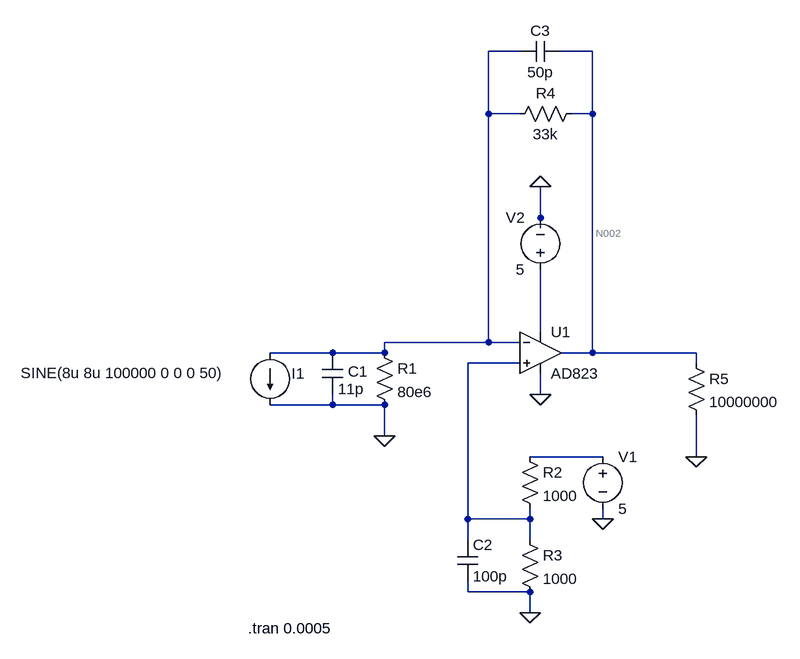
[diagram p0: schematic Optical tachometer circuit.asc]
Optical tachometer circuit.asc, the LTspice schematic file:
Version 4
SHEET 1 880 680
WIRE 192 -320 144 -320
WIRE 304 -320 256 -320
WIRE 144 -224 144 -320
WIRE 192 -224 144 -224
WIRE 304 -224 304 -320
WIRE 304 -224 272 -224
WIRE 224 -64 224 -112
WIRE 224 -48 224 -64
WIRE 224 112 224 16
WIRE 144 128 144 -224
WIRE 144 128 -16 128
WIRE 192 128 144 128
WIRE -96 144 -192 144
WIRE -16 144 -16 128
WIRE -16 144 -96 144
WIRE 304 144 304 -224
WIRE 304 144 256 144
WIRE 464 144 304 144
WIRE 192 160 112 160
WIRE 464 160 464 144
WIRE 224 208 224 176
WIRE -96 224 -96 208
WIRE -96 224 -192 224
WIRE -16 224 -96 224
WIRE -16 272 -16 224
WIRE 320 304 208 304
WIRE 464 304 464 240
WIRE 112 400 112 160
WIRE 208 400 208 384
WIRE 208 400 112 400
WIRE 320 400 320 384
WIRE 112 432 112 400
WIRE 208 432 208 400
WIRE 112 512 112 496
WIRE 208 512 112 512
WIRE 208 544 208 512
FLAG -16 272 0
FLAG 208 544 0
FLAG 464 304 0
FLAG 224 208 0
FLAG 320 400 0
FLAG 224 -112 0
SYMBOL OpAmps\\AD823 224 80 R0
SYMATTR InstName U1
SYMBOL cap -112 144 R0
WINDOW 0 40 29 Left 2
SYMATTR InstName C1
SYMATTR Value 11p
SYMBOL res -32 128 R0
SYMATTR InstName R1
SYMATTR Value 80e6
SYMBOL current -192 144 R0
WINDOW 0 33 32 Left 2
WINDOW 3 -384 31 Left 2
WINDOW 123 0 0 Left 0
WINDOW 39 0 0 Left 0
SYMATTR InstName I1
SYMATTR Value SINE(8u 8u 100000 0 0 0 50)
SYMBOL res 192 288 R0
SYMATTR InstName R2
SYMATTR Value 1000
SYMBOL res 192 416 R0
SYMATTR InstName R3
SYMATTR Value 1000
SYMBOL cap 96 432 R0
SYMATTR InstName C2
SYMATTR Value 100p
SYMBOL res 288 -240 R90
WINDOW 0 0 56 VBottom 2
WINDOW 3 32 56 VTop 2
SYMATTR InstName R4
SYMATTR Value 33k
SYMBOL cap 256 -336 R90
WINDOW 0 0 32 VBottom 2
WINDOW 3 32 32 VTop 2
SYMATTR InstName C3
SYMATTR Value 50p
SYMBOL res 448 144 R0
SYMATTR InstName R5
SYMATTR Value 10000000
SYMBOL voltage 320 288 R0
WINDOW 123 0 0 Left 0
WINDOW 39 0 0 Left 0
SYMATTR InstName V1
SYMATTR Value 5
SYMBOL voltage 224 32 R180
WINDOW 0 24 96 Left 2
WINDOW 3 24 16 Left 2
WINDOW 123 0 0 Left 0
WINDOW 39 0 0 Left 0
SYMATTR InstName V2
SYMATTR Value 5
TEXT -226 568 Left 2 !.tran 0.0005

The netlist it stands for:
* Optical tachometer circuit.asc
XU1 N004 N001 N003 0 N002 AD823  ; pins In+ In- V+ V- OUT
C1 N001 0 11p
R1 N001 0 80e6
I1 N001 0 SINE(8u 8u 100000 0 0 0 50)
R2 N005 N004 1000
R3 N004 0 1000
C2 N004 0 100p
R4 N002 N001 33k
C3 N002 N001 50p
R5 N002 0 10000000
V1 N005 0 5
V2 N003 0 5
.tran 0.0005
.lib ADI.lib
.backanno
.end

* Results of the author's LTspice run, read from the files saved beside the schematic
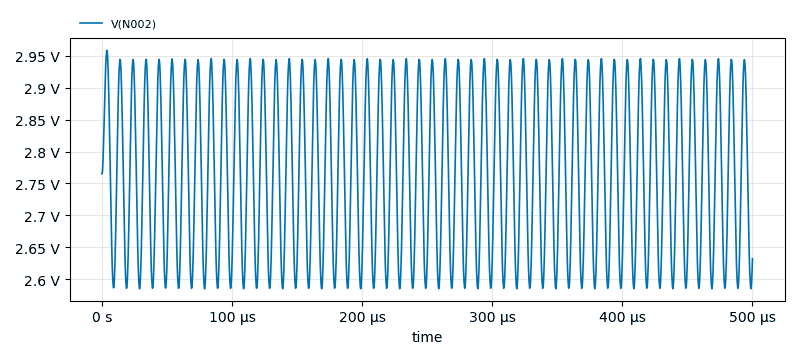
[diagram p1: Transient Analysis of Optical tachometer circuit.asc, plotted from the saved traces]
* Transient Analysis, 1 run:
*   V(N002): min 2.585 V, max 2.958 V, average 2.765 V, rms 2.768 V, last 2.632 V